# EAGLE design 8-Channel-LED-Stacker (EAGLE 5.11)
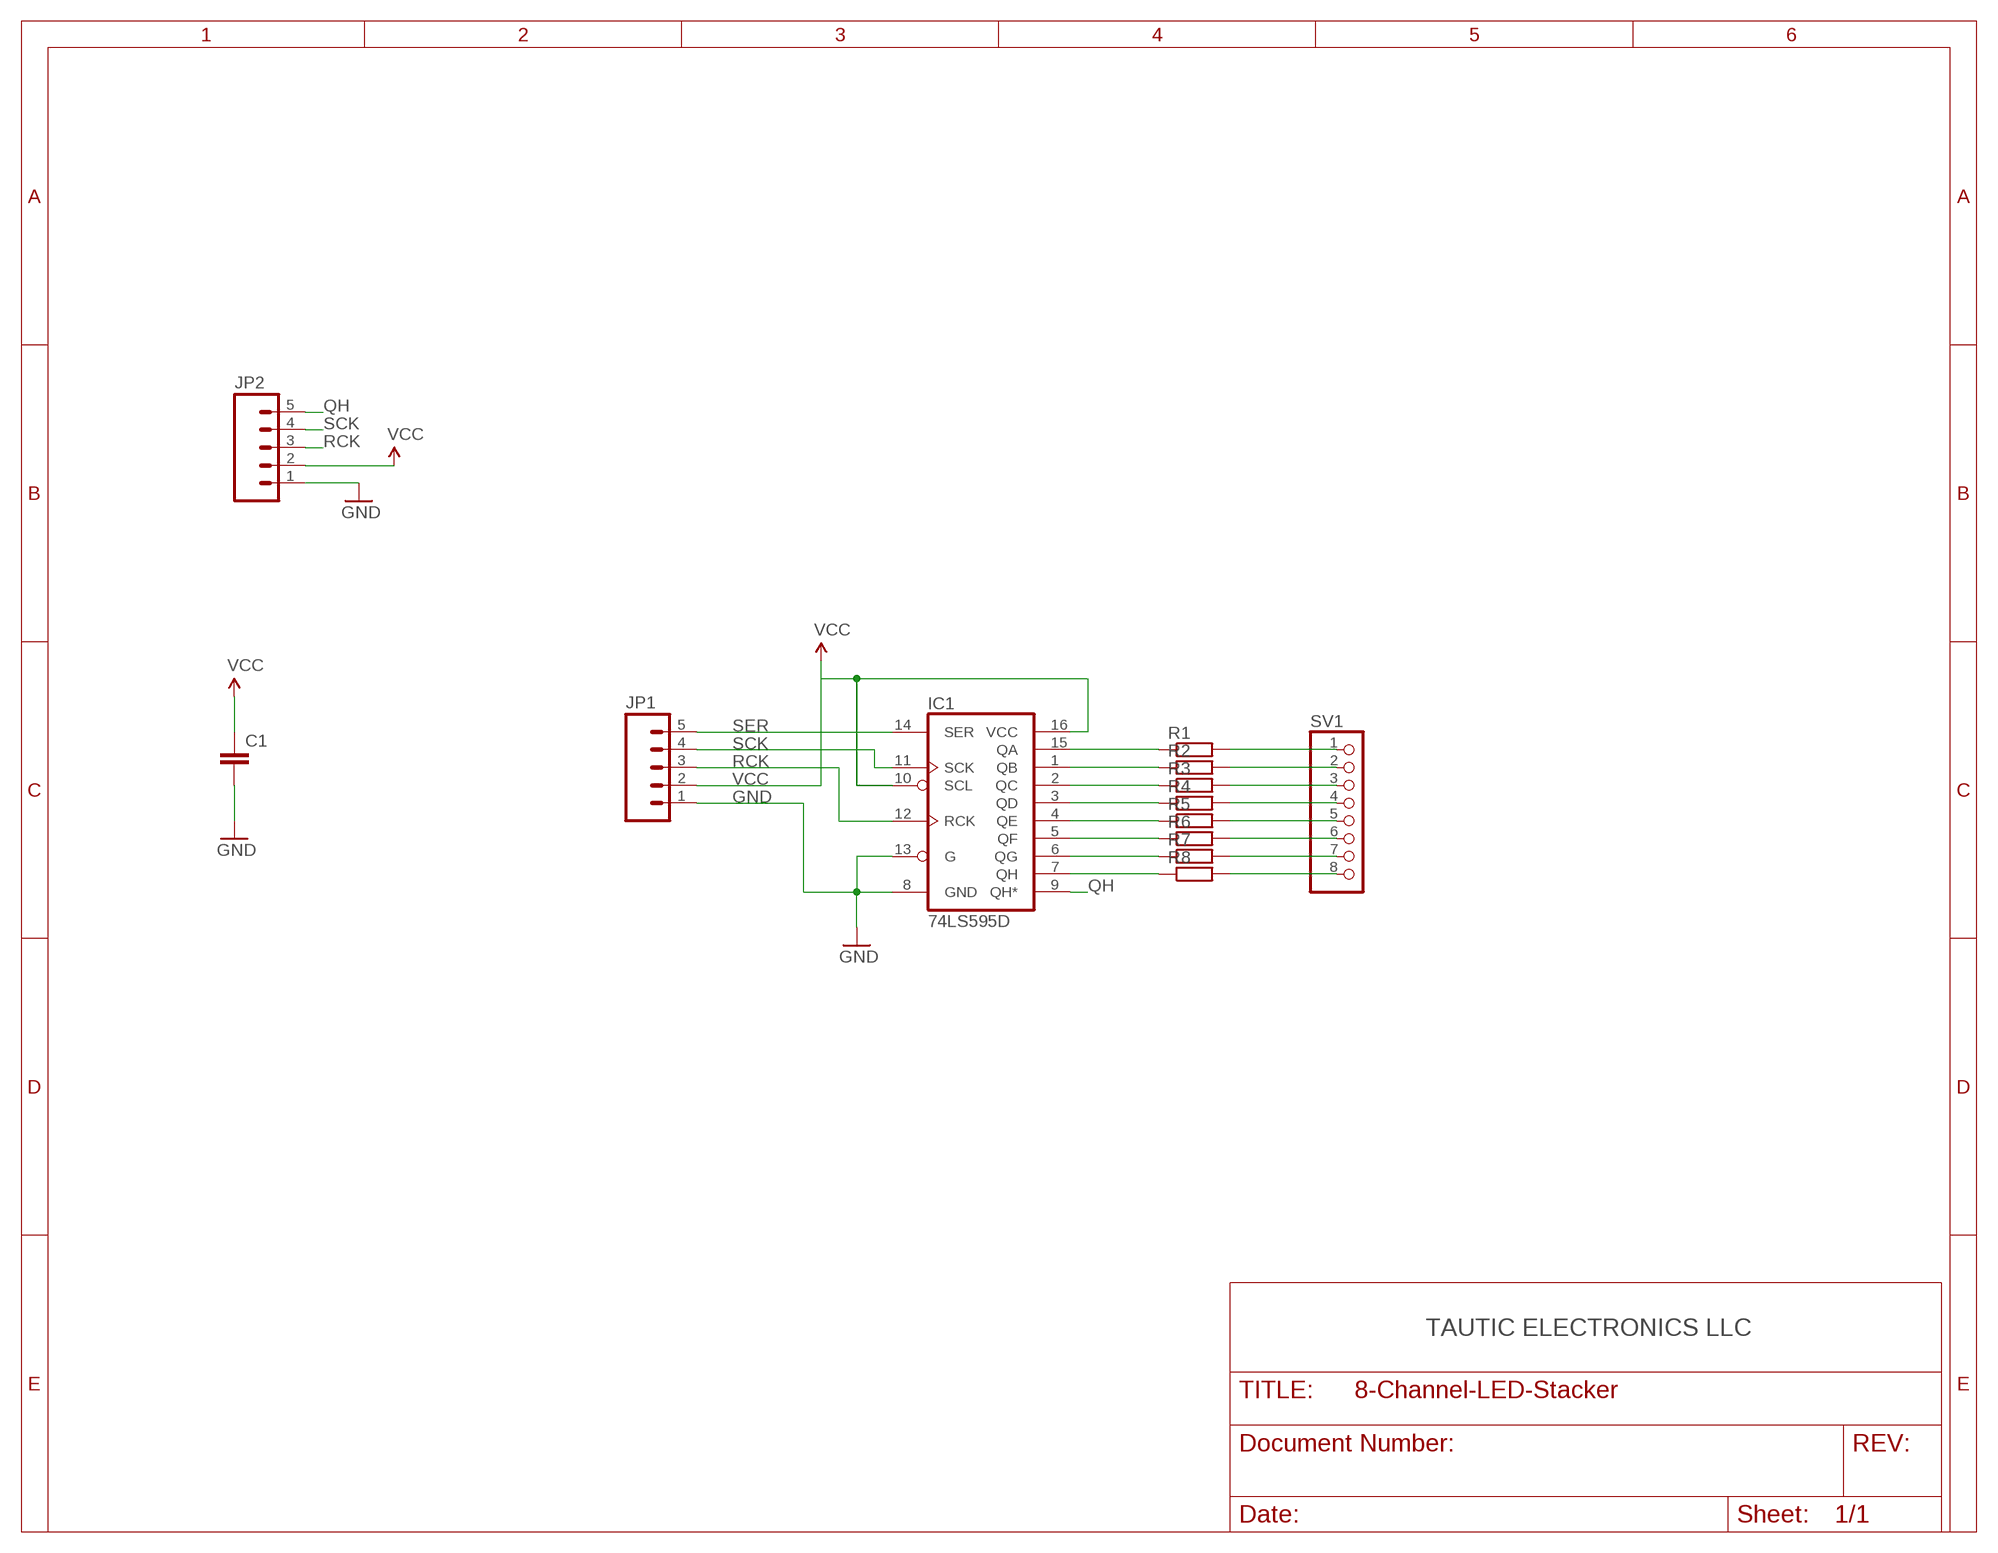
[diagram p0: schematic, sheet 1]

## Parts
C1  CAP0805  [0805]
IC1  74LS595D  [SO16]
JP1  M05PTH  [1X05]
JP2  M05PTH  [1X05]
R1  R-EU_R0805  [R0805]
R2  R-EU_R0805  [R0805]
R3  R-EU_R0805  [R0805]
R4  R-EU_R0805  [R0805]
R5  R-EU_R0805  [R0805]
R6  R-EU_R0805  [R0805]
R7  R-EU_R0805  [R0805]
R8  R-EU_R0805  [R0805]
SV1  PINHD-1X8  [1X08]

## Nets
GND: C1.2 IC1.8(GND) IC1.13(G) JP1.1 JP2.1
N$1: IC1.7(QH) R8.1
N$2: IC1.6(QG) R7.1
N$3: IC1.5(QF) R6.1
N$4: IC1.4(QE) R5.1
N$5: IC1.3(QD) R4.1
N$6: IC1.2(QC) R3.1
N$7: IC1.1(QB) R2.1
N$8: IC1.15(QA) R1.1
N$9: R1.2 SV1.1
N$10: R2.2 SV1.2
N$11: R3.2 SV1.3
N$12: R4.2 SV1.4
N$13: R5.2 SV1.5
N$14: R6.2 SV1.6
N$15: R7.2 SV1.7
N$16: R8.2 SV1.8
QH: IC1.9(QH*) JP2.5
RCK: IC1.12(RCK) JP1.3 JP2.3
SCK: IC1.11(SCK) JP1.4 JP2.4
SER: IC1.14(SER) JP1.5
VCC: C1.1 IC1.10(SCL) IC1.16(VCC) JP1.2 JP2.2

## Notes on the sheet
- TAUTIC ELECTRONICS LLC

## Library data of the parts
C1 = SparkFun:CAP: Capacitor Standard 0603 ceramic capacitor, and 0.1" leaded capacitor.
IC1 = SparkFun:74*595: 8-bit SHIFT REGISTER, output latch
JP1 JP2 = SparkFun:M05: Header 5 Standard 5-pin 0.1" header. Use with straight break away headers (SKU : PRT-00116), right angle break away headers (PRT-00553), swiss pins (PRT-00743), machine pins (PRT-00117), and female headers (PRT-00115). Molex polarized connector foot print use with SKU : PRT-08230 with associated crimp pins and housings.
R1-R8 = rcl:R-EU_: RESISTOR, European symbol
SV1 = pinhead:PINHD-1X8: PIN HEADER

## Board
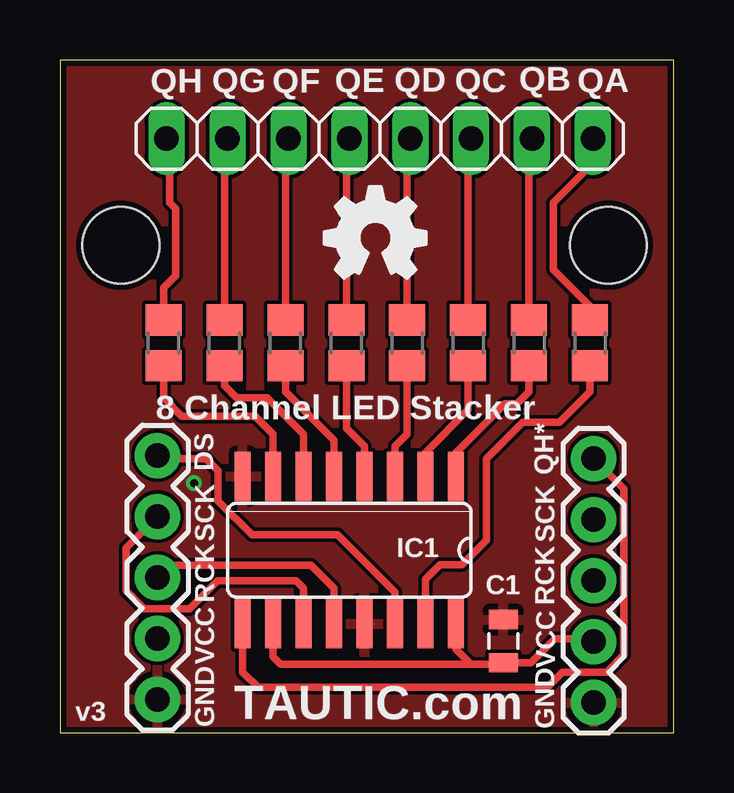
[diagram p1: board, top side]
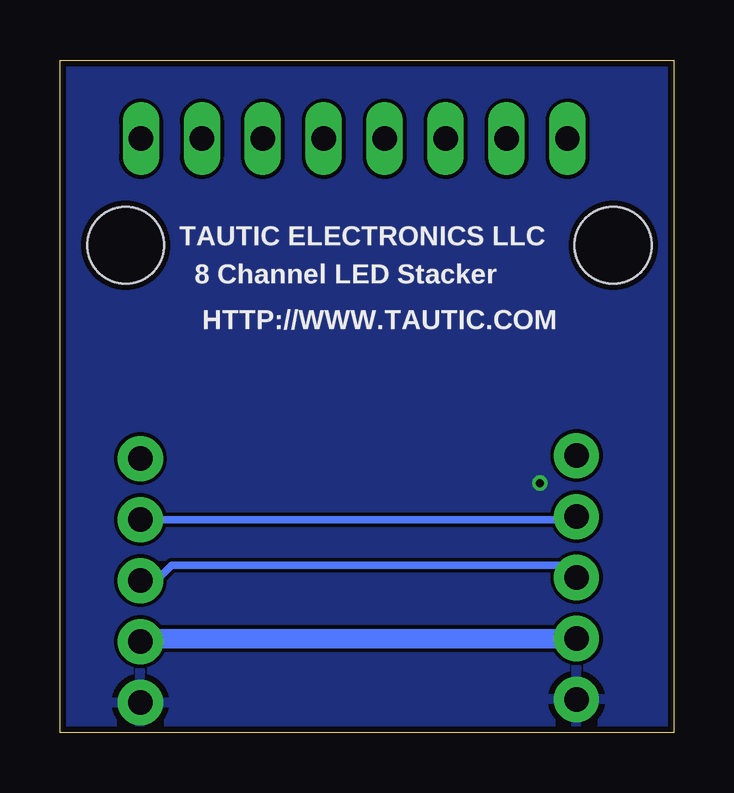
[diagram p2: board, bottom side, seen from below]

Size 25.6 x 28.04 mm. Coordinates in mm from the lower left corner, seen from the top.
Outline: 0,0 25.6,0 25.6,28.04 0,28.04 0,0
Copper layers (1*16): Top 0.035mm / dielectric 1.5mm / Bottom 0.035mm
Design rules "ITead_rule": minimum track width 6mil, minimum drill 12mil, track to track 6mil, track to pad 6mil, pad to pad 6mil, via to via 6mil, smd to smd 0mil, copper to edge 10mil, drill to drill 10mil, minimum pad ring 10mil, minimum via ring 6mil, stop-mask expansion 2mil, vias tented up to drill 100mil, thermal gap 10mil
Holes 3.2 mm at 2.54,20.32 22.86,20.32

### Footprints (pad centres in the part's own frame; a part is rotated, then mirrored left to right if it is on the bottom)
0805 = smd 0.8 x 1.2: 1 -0.9,0; 2 0.9,0
SO16 = smd 0.66 x 2.032: 1 -4.445,-3.073; 2 -3.175,-3.073; 3 -1.905,-3.073; 4 -0.635,-3.073; 5 0.635,-3.073; 6 1.905,-3.073; 7 3.175,-3.073; 8 4.445,-3.073; 9 4.445,3.073; 10 3.175,3.073; 11 1.905,3.073; 12 0.635,3.073; 13 -0.635,3.073; 14 -1.905,3.073; 15 -3.175,3.073; 16 -4.445,3.073
1X05 = drill 1.016 pad 1.88 round: 1 0,0; 2 2.54,0; 3 5.08,0; 4 7.62,0; 5 10.16,0
R0805 = smd 1.3 x 1.5: 1 -0.95,0; 2 0.95,0
1X08 = drill 1.016 long: 1 -8.89,0; 2 -6.35,0; 3 -3.81,0; 4 -1.27,0; 5 1.27,0; 6 3.81,0; 7 6.35,0; 8 8.89,0

### Placement (x,y rotation side)
C1  18.48,3.83 90 top
IC1  12.06,7.62 180 top
JP1  4.06,1.4 90 top
JP2  22.25,1.27 90 top
R1  22.1,16.26 90 top
R2  19.56,16.26 90 top
R3  17.02,16.26 90 top
R4  14.48,16.26 90 top
R5  11.94,16.26 90 top
R6  9.4,16.26 90 top
R7  6.86,16.26 90 top
R8  4.32,16.26 90 top
SV1  13.34,24.77 180 top
U$1  [OSHW_FILLX150_NOTEXT]  11.02,18.95 0 top

### Tracks (layer width: path | path; a pad name or v marks a point on that pad's centre or on a via)
GND  (via drill 0.33)
  other vias: 5.59,10.41
  pour Top: -1.02,-1.02 -1.02,28.07 32,28.57 32,-0.51
  pour Bottom: -2.03,-2.29 -2.03,29.08 32.77,29.34 32.77,-2.03
N$1
  Top 0.305: IC1.7 8.89,12.45 8.13,13.21 5.08,13.21 4.32,13.97 R8.1
N$2
  Top 0.305: IC1.6 10.16,12.45 8.64,13.97 7.37,13.97 6.86,14.48 R7.1
N$3
  Top 0.305: IC1.5 11.43,12.19 9.4,14.22 R6.1
N$4
  Top 0.305: IC1.4 12.7,11.94 11.94,12.7 R5.1
N$5
  Top 0.305: IC1.3 13.97,11.94 14.48,12.45 R4.1
N$6
  Top 0.305: IC1.2 15.24,11.68 17.02,13.46 R3.1
N$7
  Top 0.305: IC1.1 16.51,11.68 18.54,13.72 19.05,13.72 19.56,14.22 R2.1
N$8
  Top 0.305: IC1.15 15.24,6.4 15.85,7.01 16.76,7.01 17.78,8.03 17.78,11.43 19.3,12.95 20.83,12.95 22.1,14.22 R1.1
N$9
  Top 0.305: R1.2 22.1,17.78 20.57,19.3 20.57,22.1 22.1,23.62 22.1,24.64 SV1.1
N$10
  Top 0.305: R2.2 19.56,24.64 SV1.2
N$11
  Top 0.305: R3.2 17.02,24.64 SV1.3
N$12
  Top 0.305: R4.2 14.48,24.64 SV1.4
N$13
  Top 0.305: R5.2 11.94,24.64 SV1.5
N$14
  Top 0.305: R6.2 9.4,24.64 SV1.6
N$15
  Top 0.305: R7.2 6.86,24.64 SV1.7
N$16
  Top 0.305: R8.2 4.32,18.54 4.83,19.05 4.83,21.84 4.57,22.1 4.57,24.64 SV1.8
QH
  Top 0.305: JP2.5 23.51,10.17 23.51,3.25 22.8,2.54 20.95,2.54 20.32,1.91 8.26,1.91 7.62,2.54 IC1.9
RCK
  Top 0.305: IC1.12 11.43,6.03 10.48,6.99 4.57,6.99 JP1.3
  Bottom 0.203: JP1.3 4.19,6.35
  Bottom 0.305: 4.19,6.35 4.19,6.41 4.76,6.99 20.95,6.99 21.59,6.35 JP2.3
SCK
  Top 0.305: JP1.4 2.77,7.72 2.77,5.93 3.52,5.18 5.41,5.18 6.58,6.35 9.84,6.35 10.16,6.03 IC1.11
  Bottom 0.203: JP1.4 4.19,8.89
  Bottom 0.305: 4.19,8.89 JP2.4
SER
  Top 0.305: IC1.14 13.97,5.87 11.58,8.26 8,8.26 6.6,9.65 6.6,10.92 6.1,11.43 4.19,11.43 JP1.5
VCC
  Top 0.203: IC1.10 8.94,4.47
  Top 0.305: 16.46,4.5 IC1.16 16.51,3.49 17.14,2.86 | IC1.10 8.89,3.17 9.21,2.86 17.14,2.86 | 17.14,2.86 18.41,2.86 C1.1 19.63,2.93 20.64,3.94 22.12,3.94 JP2.2
  Bottom 0.203: 22.25,3.94 JP2.2
  Bottom 0.813: JP1.2 22.25,3.94

### Text on the board
tPlace: QH | QG | QF | QE | QD | QC | QB | QA | 8 Channel LED Stacker | DS | QH* | SCK | SCK | RCK | RCK | VCC | VCC | TAUTIC.com | GND | GND
bPlace: TAUTIC ELECTRONICS LLC | 8 Channel LED Stacker | HTTP://WWW.TAUTIC.COM
tNames: v3
bStop: TAUTIC.COM